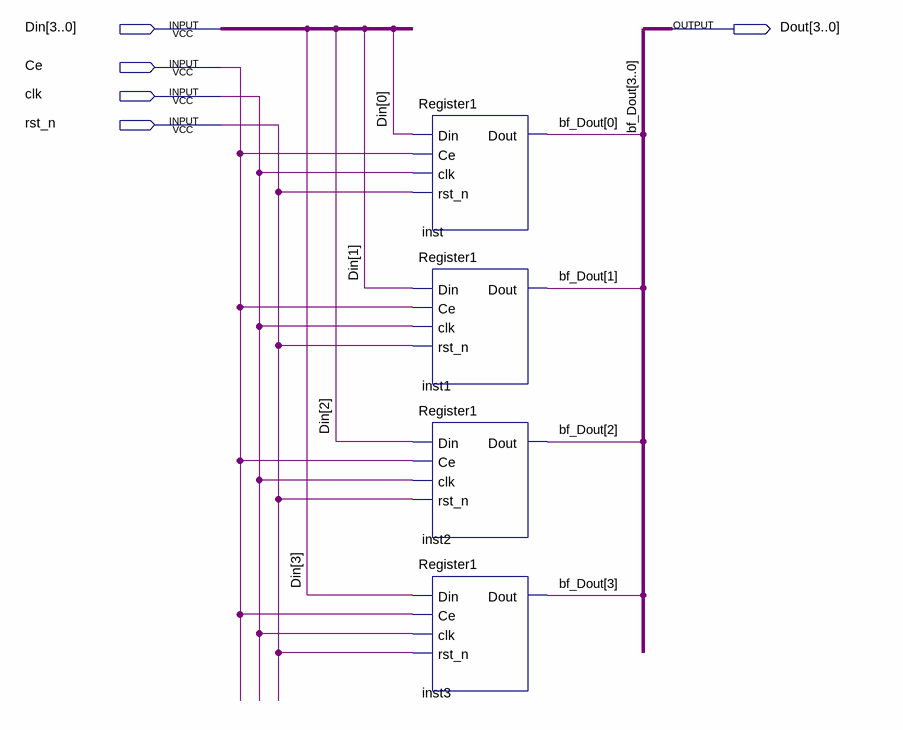
[diagram p0: schematic sheet]
// Quartus schematic Register4.bdf as structural Verilog: 4 symbols, 5 pins
module Register4 (
  input  [3:0] Din,
  input  Ce,
  input  clk,
  input  rst_n,
  output [3:0] Dout
);

  Register1 inst (.Din(Din[0]), .Ce(Ce), .clk(clk), .rst_n(rst_n), .Dout(Dout[0]));
  Register1 inst1 (.Din(Din[1]), .Ce(Ce), .clk(clk), .rst_n(rst_n), .Dout(Dout[1]));
  Register1 inst2 (.Din(Din[2]), .Ce(Ce), .clk(clk), .rst_n(rst_n), .Dout(Dout[2]));
  Register1 inst3 (.Din(Din[3]), .Ce(Ce), .clk(clk), .rst_n(rst_n), .Dout(Dout[3]));

  // Other names for the same wires on the sheet: bf_Dout[3:0] = Dout
endmodule
